# EAGLE design card_env_sensor_1 (EAGLE 9.7.0)
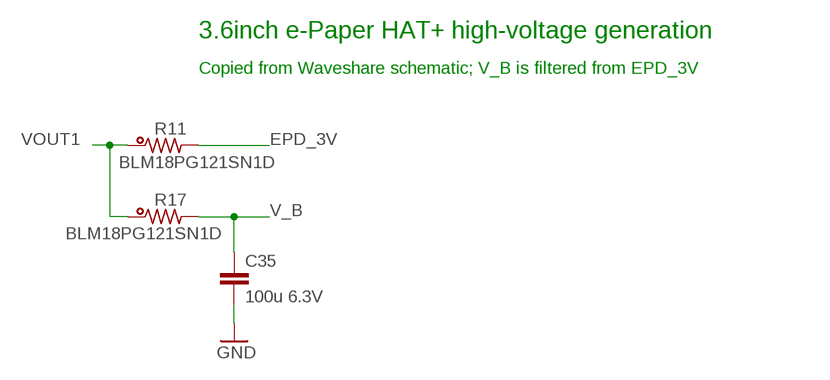
[diagram p0: schematic, sheet 1, part 1 of 2]
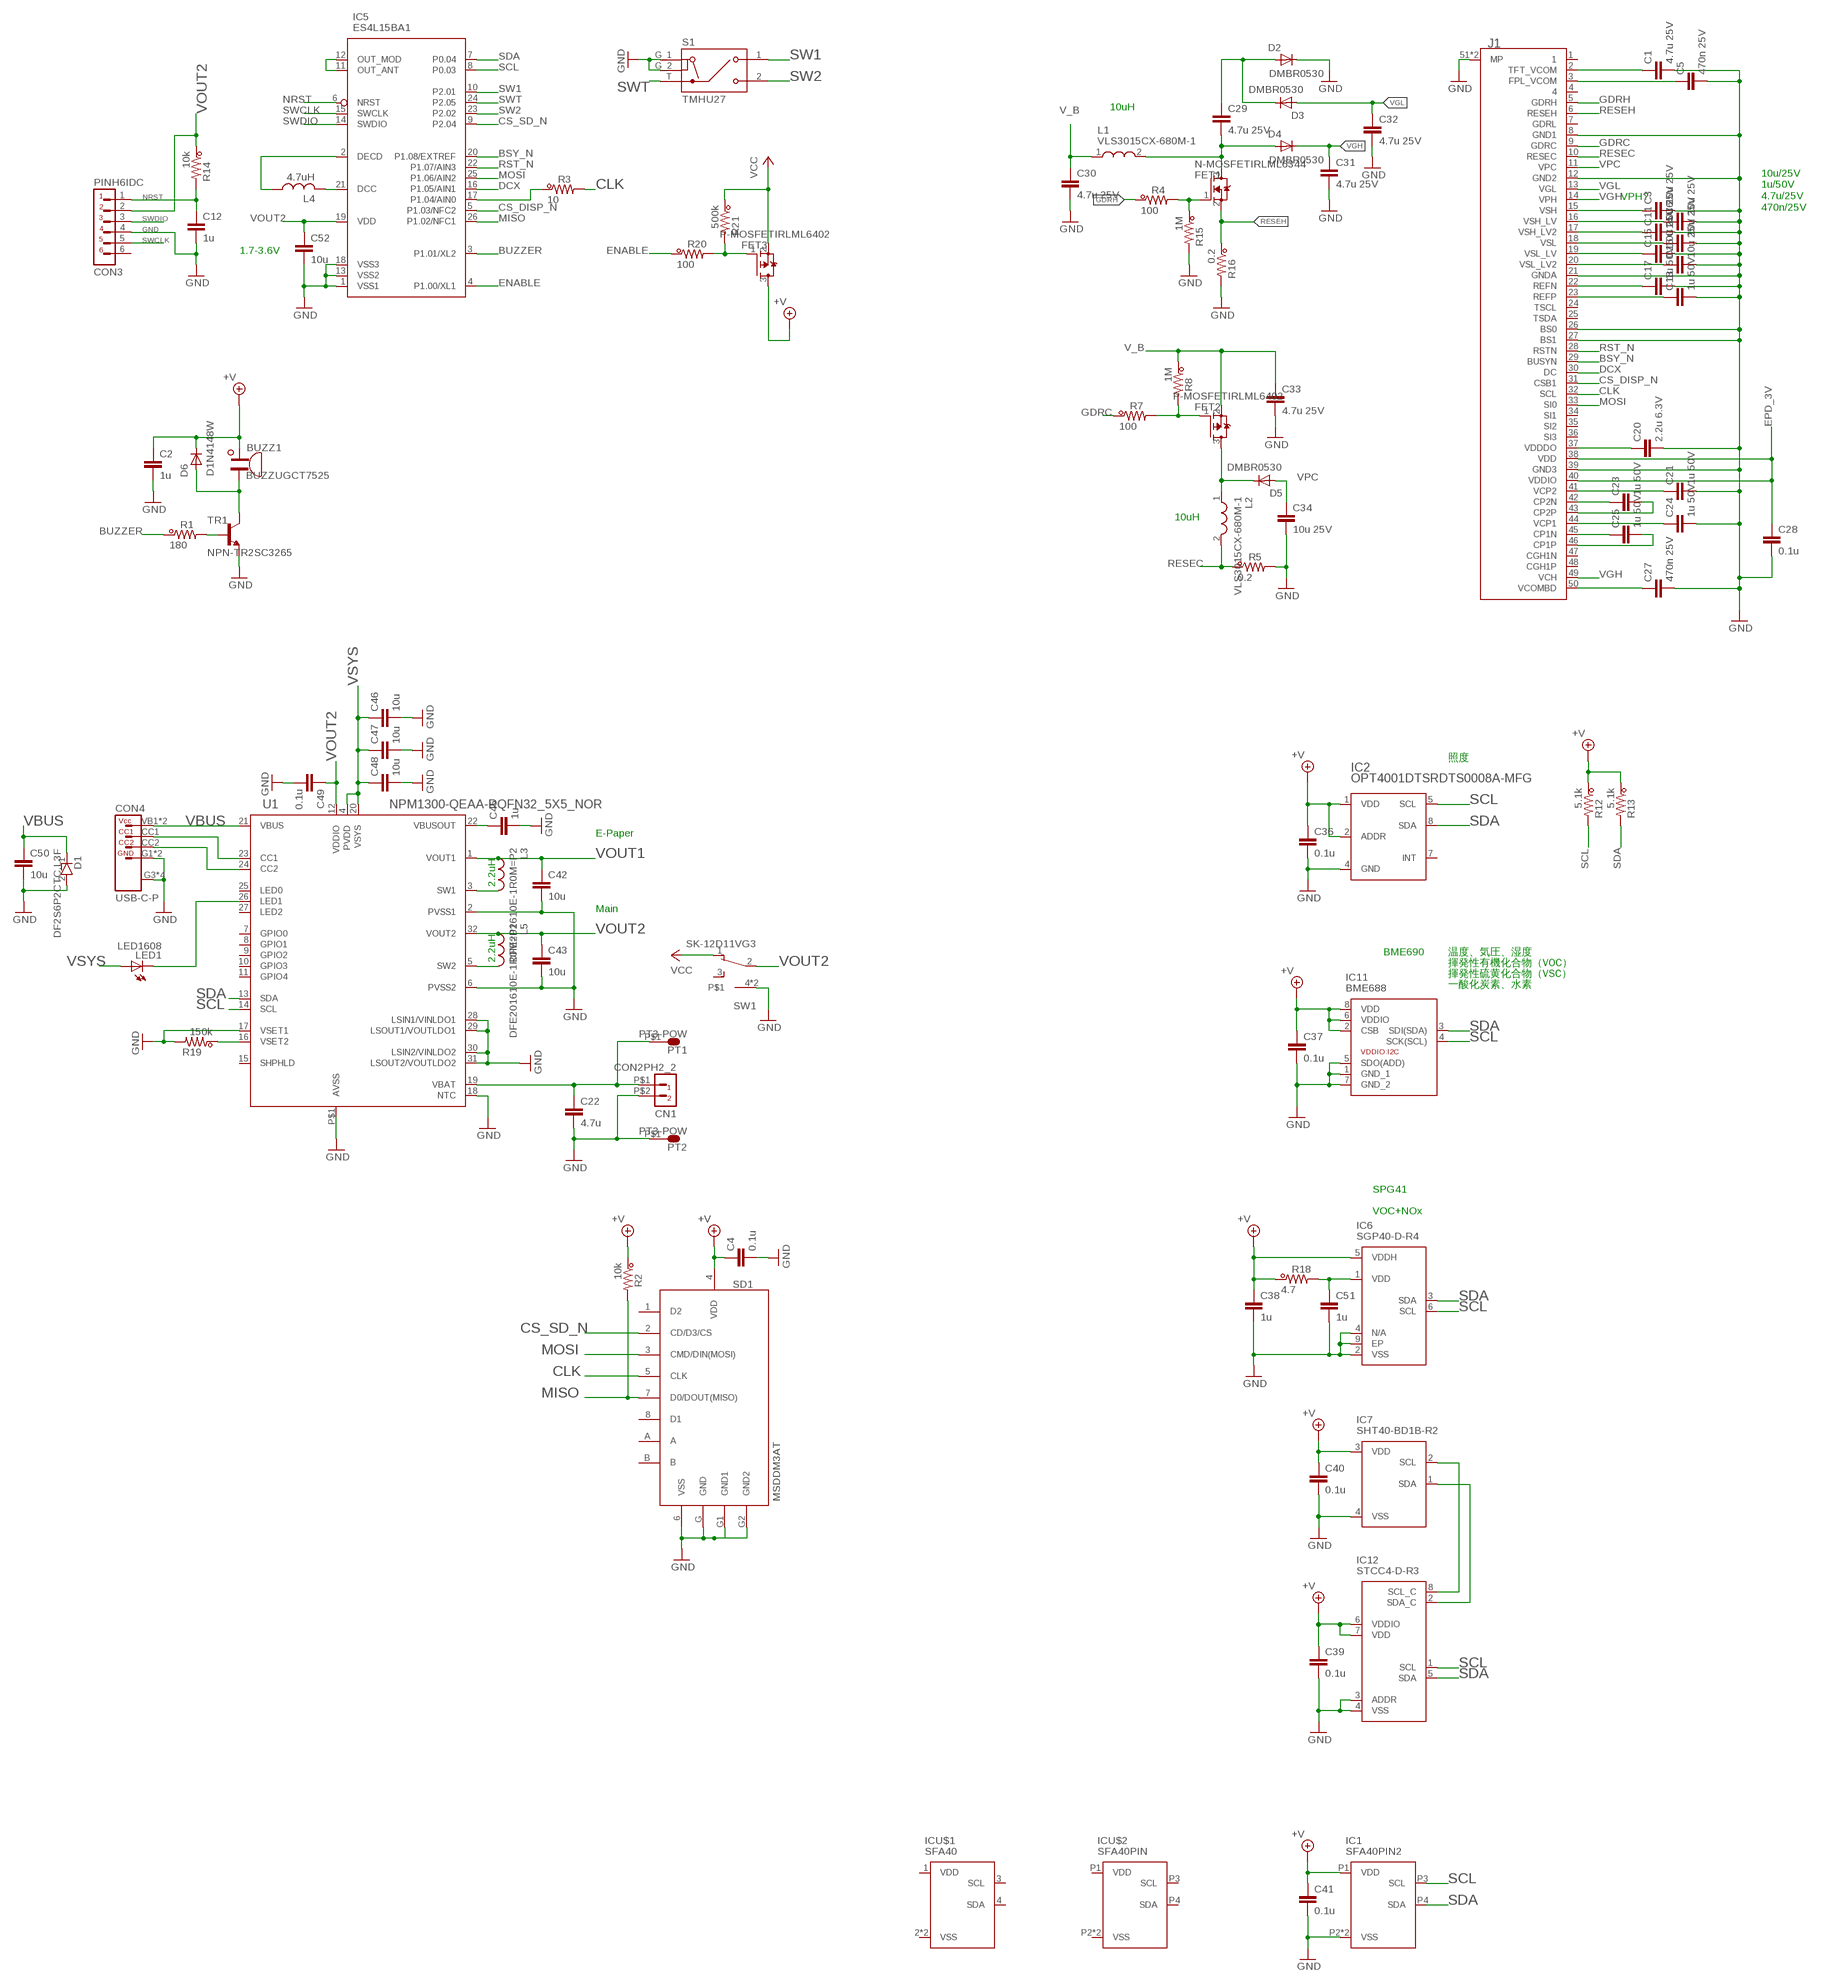
[diagram p1: schematic, sheet 1, part 2 of 2]

## Parts
BUZZ1  BUZZUGCT7525  [UGCT7525]
C1  4.7u 25V  C-CC1608A  [1608A]
C2  1u  C-CC1005A  [1005A]
C3  10u 25V  C-CC1608A  [1608A]
C4  0.1u  C-CC1005A  [1005A]
C5  470n 25V  C-CC1608A  [1608A]
C6  10u 25V  C-CC1608A  [1608A]
C11  10u 25V  C-CC1608A  [1608A]
C12  1u  C-CC1005A  [1005A]
C14  10u 25V  C-CC1608A  [1608A]
C15  10u 25V  C-CC1608A  [1608A]
C16  10u 25V  C-CC1608A  [1608A]
C17  1u 50V  C-CC1608A  [1608A]
C18  1u 50V  C-CC1608A  [1608A]
C20  2.2u 6.3V  C-CC1608A  [1608A]
C21  1u 50V  C-CC1608A  [1608A]
C22  4.7u  C-CC1608A  [1608A]
C23  1u 50V  C-CC1608A  [1608A]
C24  1u 50V  C-CC1608A  [1608A]
C25  1u 50V  C-CC1608A  [1608A]
C27  470n 25V  C-CC1608A  [1608A]
C28  0.1u  C-CC1005A  [1005A]
C29  4.7u 25V  C-CC1608A  [1608A]
C30  4.7u 25V  C-CC1608A  [1608A]
C31  4.7u 25V  C-CC1608A  [1608A]
C32  4.7u 25V  C-CC1608A  [1608A]
C33  4.7u 25V  C-CC1608A  [1608A]
C34  10u 25V  C-CC1608A  [1608A]
C35  100u 6.3V  C-CC3225  [3225-C]
C36  0.1u  C-CC1005K  [1005K]
C37  0.1u  C-CC1005K  [1005K]
C38  1u  C-CC1005K  [1005K]
C39  0.1u  C-CC1005K  [1005K]
C40  0.1u  C-CC1005K  [1005K]
C41  0.1u  C-CC1005K  [1005K]
C42  10u  C-CC1608A  [1608A]
C43  10u  C-CC1608A  [1608A]
C45  1u  C-CC1608A  [1608A]
C46  10u  C-CC1608A  [1608A]
C47  10u  C-CC1608A  [1608A]
C48  10u  C-CC1608A  [1608A]
C49  0.1u  C-CC1608A  [1608A]
C50  10u  C-CC2015  [2015]
C51  1u  C-CC1005K  [1005K]
C52  10u  C-CC1608A  [1608A]
CN1  CON2PH2_2  [PH2_2]
CON3  PINH6IDC  [1X6IDC_1R27]
CON4  USB-C-P  [USB-C-P]
D1  DF2S6P2CTC,L3F  [CST2C]
D2  DMBR0530  [SOD-123-2]
D3  DMBR0530  [SOD-123-2]
D4  DMBR0530  [SOD-123-2]
D5  DMBR0530  [SOD-123-2]
D6  D1N4148W  [1N4148W]
FET1  N-MOSFETIRLML6344  [SOT23-3]
FET2  P-MOSFETIRLML6402  [SOT23-3]
FET3  P-MOSFETIRLML6402  [SOT23-3]
IC1  SFA40PIN2  [SFA40-PIN2]
IC2  OPT4001DTSRDTS0008A-MFG  [DTS0008A-MFG]
IC5  ES4L15BA1  [ES4L15BA1]
IC6  SGP40-D-R4  [SON80P244X244X95-7N]
IC7  SHT40-BD1B-R2  [SHT40BD1BR2]
IC11  BME688  [BME688]
IC12  STCC4-D-R3  [STCC4DR3]
ICU$1  SFA40  [SFA40]
ICU$2  SFA40PIN  [SFA40-PIN]
J1  FH34SRJ-50S-0.5SH(50)CONN50X1_FH34SRJ-50S-0.5SH(50)  [CONN50X1_FH34SRJ-50S-0.5SH(50)]
L1  VLS3015CX-680M-1  [VLS3015]
L2  VLS3015CX-680M-1  [VLS3015]
L3  DFE201610E-1R0M=P2  [INDC2016X100N]
L4  4.7uH  L1608  [1608A]
L5  DFE201610E-1R0M=P2  [INDC2016X100N]
LED1  LED1608  [LED1608]
PT1  PT3-POW  [PT3-POW]
PT2  PT3-POW  [PT3-POW]
R1  180  R-CC1005A  [1005A]
R2  10k  R-CC1005A  [1005A]
R3  10  R-CC1005A  [1005A]
R4  100  R-CC1005A  [1005A]
R5  0.2  R-CC2012A  [2012A]
R7  100  R-CC1005A  [1005A]
R8  1M  R-CC1005A  [1005A]
R11  BLM18PG121SN1D  R-CC1608A  [1608A]
R12  5.1k  R-CC1005A  [1005A]
R13  5.1k  R-CC1005A  [1005A]
R14  10k  R-CC1005A  [1005A]
R15  1M  R-CC1005A  [1005A]
R16  0.2  R-CC2012A  [2012A]
R17  BLM18PG121SN1D  R-CC1608A  [1608A]
R18  4.7  R-CC1005A  [1005A]
R19  150k  R-CC1005A  [1005A]
R20  100  R-CC1005A  [1005A]
R21  500k  R-CC1005A  [1005A]
S1  TMHU27  [SW_TMHU27]
SD1  MSDDM3AT  [DM3AT]
SW1  SK-12D11VG3  [SK-12D11VG3]
TR1  NPN-TR2SC3265  [SOT23-3]
U1  NPM1300-QEAA-RQFN32_5X5_NOR  [QFN32_5X5_NOR]

## Nets
+V: BUZZ1.P(+) C2.1 C4.1 C36.1 C37.1 C38.1 C39.1 C40.1 C41.1 D6.C FET3.3(D) IC1.P1(VDD) IC2.1(VDD) IC2.2(ADDR) IC6.5(VDDH) IC7.3(VDD) IC11.2(CSB) IC11.6(VDDIO) IC11.8(VDD) IC12.6(VDDIO) IC12.7(VDD) R2.1 R12.1 R13.1 R18.1 SD1.4(VDD)
BSY_N: IC5.20(P1.08/EXTREF) J1.29(BUSYN)
BUZZER: IC5.3(P1.01/XL2) R1.1
CLK: J1.32(SCL) R3.2 SD1.5(CLK)
CS_DISP_N: IC5.5(P1.03/NFC2) J1.31(CSB1)
CS_SD_N: IC5.9(P2.04) SD1.2(CD/D3/CS)
DCX: IC5.16(P1.05/AIN1) J1.30(DC)
ENABLE: IC5.4(P1.00/XL1) R20.1
EPD_3V: C28.1 J1.38(VDD) J1.40(VDDIO) R11.2
GDRC: J1.9(GDRC) R7.1
GDRH: J1.5(GDRH) R4.1
GND: C1.2 C2.2 C3.2 C4.2 C5.2 C6.2 C11.2 C12.2 C14.2 C15.2 C16.2 C17.2 C18.2 C20.2 C21.2 C22.2 C24.2 C27.2 C28.2 C30.2 C31.2 C32.2 C33.2 C34.2 C35.2 C36.2 C37.2 C38.2 C39.2 C40.2 C41.2 C42.2 C43.2 C45.2 C46.2 C47.2 C48.2 C49.2 C50.2 C51.2 C52.2 CN1.P$2 CON3.4 CON4.G1(G) CON4.G2(G) CON4.G3(G1) CON4.G4(G1) CON4.G5(G1) CON4.G6(G1) D1.2(A) D2.C IC1.P2(VSS) IC1.P6(VSS) IC2.4(GND) IC5.1(VSS1) IC5.13(VSS2) IC5.18(VSS3) IC6.2(VSS) IC6.4(N/A) IC6.9(EP) IC7.4(VSS) IC11.1(GND_1) IC11.5(SDO(ADD)) IC11.7(GND_2) IC12.3(ADDR) IC12.4(VSS) J1.8(GND1) J1.12(GND2) J1.21(GNDA) J1.26(BS0) J1.27(BS1) J1.39(GND3) J1.51(MP) J1.52(MP) PT2.P$1 R5.2 R15.2 R16.2 R19.2 S1.G_1(C1) S1.G_2(C2) SD1.6(VSS) SD1.G1(GND1) SD1.G2(GND2) SD1.G(GND) SW1.4 SW1.5 TR1.2(E) U1.2(PVSS1) U1.6(PVSS2) U1.17(VSET1) U1.18(NTC) U1.28(LSIN1/VINLDO1) U1.29(LSOUT1/VOUTLDO1) U1.30(LSIN2/VINLDO2) U1.31(LSOUT2/VOUTLDO2) U1.P$1(AVSS)
MISO: IC5.26(P1.02/NFC1) R2.2 SD1.7(D0/DOUT(MISO))
MOSI: IC5.25(P1.06/AIN2) J1.33(SI0) SD1.3(CMD/DIN(MOSI))
N$1: IC5.17(P1.04/AIN0) R3.1
N$2: R1.2 TR1.1(B)
N$3: LED1.K(C) U1.26(LED1)
N$13: BUZZ1.N(-) D6.A TR1.3(C)
N$25: C1.1 J1.2(TFT_VCOM)
N$26: C5.1 J1.3(FPL_VCOM)
N$28: C51.1 IC6.1(VDD) R18.2
N$29: CON4.CC1 U1.23(CC1)
N$30: C29.2 D4.A FET1.3(D) L1.2
N$31: C3.1 J1.15(VSH)
N$32: C6.1 J1.16(VSH_LV)
N$34: C11.1 J1.17(VSH_LV2)
N$35: C14.1 J1.18(VSL)
N$36: C15.1 J1.19(VSL_LV)
N$37: C16.1 J1.20(VSL_LV2)
N$38: C17.1 J1.22(REFN)
N$40: C18.1 J1.23(REFP)
N$41: C21.1 J1.41(VCP2)
N$42: C23.1 J1.42(CP2N)
N$43: C23.2 J1.43(CP2P)
N$44: C27.1 J1.50(VCOMBD)
N$45: C24.1 J1.44(VCP1)
N$46: C25.1 J1.45(CP1N)
N$47: C25.2 J1.46(CP1P)
N$48: C20.1 J1.37(VDDDO)
N$49: C29.1 D2.A D3.C
N$50: FET1.1(G) R4.2 R15.1
N$51: IC5.21(DCC) L4.2
N$52: FET2.1(G) R7.2 R8.2
N$53: IC7.2(SCL) IC12.8(SCL_C)
N$54: D5.C FET2.3(D) L2.1
N$55: IC7.1(SDA) IC12.2(SDA_C)
N$56: C45.1 U1.22(VBUSOUT)
N$57: L3.2 U1.3(SW1)
N$58: R19.1 U1.16(VSET2)
N$59: L5.2 U1.5(SW2)
N$60: CON4.CC2 U1.24(CC2)
N$61: IC5.2(DECD) L4.1
N$62: FET3.1(G) R20.2 R21.2
N$63: IC5.11(OUT_ANT) IC5.12(OUT_MOD)
NRST: C12.1 CON3.1 IC5.6(NRST) R14.2
RESEC: J1.10(RESEC) L2.2 R5.1
RESEH: FET1.2(S) J1.6(RESEH) R16.1
RST_N: IC5.22(P1.07/AIN3) J1.28(RSTN)
SCL: IC1.P3(SCL) IC2.5(SCL) IC5.8(P0.03) IC6.6(SCL) IC11.4(SCK(SCL)) IC12.1(SCL) R12.2 U1.14(SCL)
SDA: IC1.P4(SDA) IC2.8(SDA) IC5.7(P0.04) IC6.3(SDA) IC11.3(SDI(SDA)) IC12.5(SDA) R13.2 U1.13(SDA)
SW1: IC5.10(P2.01) S1.1
SW2: IC5.23(P2.02) S1.2
SWCLK: CON3.5 IC5.15(SWCLK)
SWDIO: CON3.3 IC5.14(SWDIO)
SWT: IC5.24(P2.05) S1.T
V_B: C30.1 C33.1 C35.1 FET2.2(S) L1.1 R8.1 R17.2
VBAT: C22.1 CN1.P$1 PT1.P$1 U1.19(VBAT)
VBUS: C50.1 CON4.VB1(VB) CON4.VB2(VB) D1.1(K) U1.21(VBUS)
VCC: FET3.2(S) R21.1 SW1.1
VGH: C31.1 D4.C J1.14(VPH) J1.49(VCH)
VGL: C32.1 D3.A J1.13(VGL)
VOUT1: C42.1 L3.1 R11.1 R17.1 U1.1(VOUT1)
VOUT2: C43.1 C49.1 C52.1 CON3.2 IC5.19(VDD) L5.1 R14.1 SW1.2 U1.12(VDDIO) U1.32(VOUT2)
VPC: C34.1 D5.A J1.11(VPC)
VSYS: C46.1 C47.1 C48.1 LED1.A U1.4(PVDD) U1.20(VSYS)
Unconnected: CON3.6 IC2.7(INT) ICU$1.1(VDD) ICU$1.2(VSS) ICU$1.3(SCL) ICU$1.4(SDA) ICU$1.6(VSS) ICU$2.P1(VDD) ICU$2.P2(VSS) ICU$2.P3(SCL) ICU$2.P4(SDA) ICU$2.P6(VSS) J1.1 J1.4 J1.7(GDRL) J1.24(TSCL) J1.25(TSDA) J1.34(SI1) J1.35(SI2) J1.36(SI3) J1.47(CGH1N) J1.48(CGH1P) SD1.1(D2) SD1.8(D1) SD1.A SD1.B SW1.3 U1.7(GPIO0) U1.8(GPIO1) U1.9(GPIO2) U1.10(GPIO3) U1.11(GPIO4) U1.15(SHPHLD) U1.25(LED0) U1.27(LED2)

## Notes on the sheet
- 3.6inch e-Paper HAT+ high-voltage generation
- Copied from Waveshare schematic; V_B is filtered from EPD_3V
- 10uH
- VPH?
- 10u/25V
  1u/50V
  4.7u/25V
  470n/25V
- 1.7-3.6V
- 10uH
- 照度
- E-Paper
- 2.2uH
- Main
- 2.2uH
- BME690 | 温度、気圧、湿度
- 揮発性有機化合物（VOC）
- 揮発性硫黄化合物（VSC）
- 一酸化炭素、水素
- SPG41
- VOC+NOx

## Library data of the parts
BUZZ1 = dac:BUZZ; SHOP: AKI
C1-C6 C11 C12 C14-C18 C20-C25 C27-C43 C45-C52 = dac:C-CC
CN1 = dac:CON2
CON3 = dac:PINH6
CON4 = dac:USB-C-P
D1 = SamacSys_Parts:DF2S6P2CTC,L3F
D2-D6 = dac:D
FET1 = dac:N-MOSFET; PARTS: ML6344; SHOP: AKI
FET2 FET3 = dac:P-MOSFET; PARTS: ML6402; SHOP: AKI
IC1 ICU$1 ICU$2 = SamacSys_Parts:SFA40
IC2 = SamacSys_Parts:OPT4001DTSR
IC5 = SamacSys_Parts:ES4L15BA1: Board Mount Motion & Position Sensors 9-axis IMU Source: Datasheet <https://www.ceva-dsp.com/wp-content/uploads/2019/10/BNO080_085-Datasheet.pdf>
IC6 = SamacSys_Parts:SGP40-D-R4: Air Quality Sensors Gas Sensor 2.5k pcs IC Source: Datasheet; PARTS: SPG41
IC7 = SamacSys_Parts:SHT40-BD1B-R2: SENSIRION - SHT40-BD1B-R2 - Humidity and Temperature Sensor, Digital, 0% to 100% RH, I2C, DFN-EP-4, -40C to 125C Source: Datasheet <https://sensirion.com/media/documents/33FD6951/63E1087C/Datasheet_SHT4x_1.pdf>; PARTS: SHT4x-Axx
IC11 = SamacSys_Parts:BME688: Gas sensor measuring relative humidity, barometric pressure, ambient temperature and gas (VOC) Source: Datasheet <https://www.bosch-sensortec.com/media/boschsensortec/downloads/datasheets/bst-bme688-ds000.pdf>; PARTS: BME690
IC12 = SamacSys_Parts:STCC4-D-R3: Air Quality Sensors STCC4-D-R3 CO2 I2C, SMD ToR 1500 pcs 2.7V ~ 5.5V 950A 10C ~ 40C Source: Datasheet <https://sensirion.com/media/documents/6AED4B15/684A889C/CD_DS_STCC4_D1_3.pdf>
J1 = SamacSys_Parts:FH34SRJ-50S-0.5SH(50); PARTS: FH34SRJ-50S-0.5SH(50)
L1 L2 = SamacSys_Parts:VLS3015CX-680M-1: SMD / SMT Inductors (Coils), L=68?H, L x W x T : Source: Datasheet <https://product.tdk.com/system/files/dam/doc/product/inductor/inductor/smd/catalog/inductor_commercial_power_vls3015cx-1_en.pdf>; PARTS: VLS3015CX-100M-1
L3 L5 = SamacSys_Parts:DFE201610E-1R0M=P2; PARTS: DFE201610E-2R2M=P2
L4 = dac:L; PARTS: LSQPB160807T4R7M; SHOP: mouser
LED1 = dac:LED: LED rectangle, 5.7 x 3.2 mm
PT1 PT2 = dac:PT3-POW
R1-R5 R7 R8 R12-R16 R18-R21 = dac:R-CC
R11 R17 = dac:R-CC; SHOP: AKI
S1 = SamacSys_Parts:TMHU27; SHOP: AKI
SD1 = dac:MSD
SW1 = dac:SK-12D11VG3; SHOP: AKI
TR1 = dac:NPN-TR; SHOP: AKI
U1 = SamacSys_Parts:NPM1300-QEAA-R

## Board
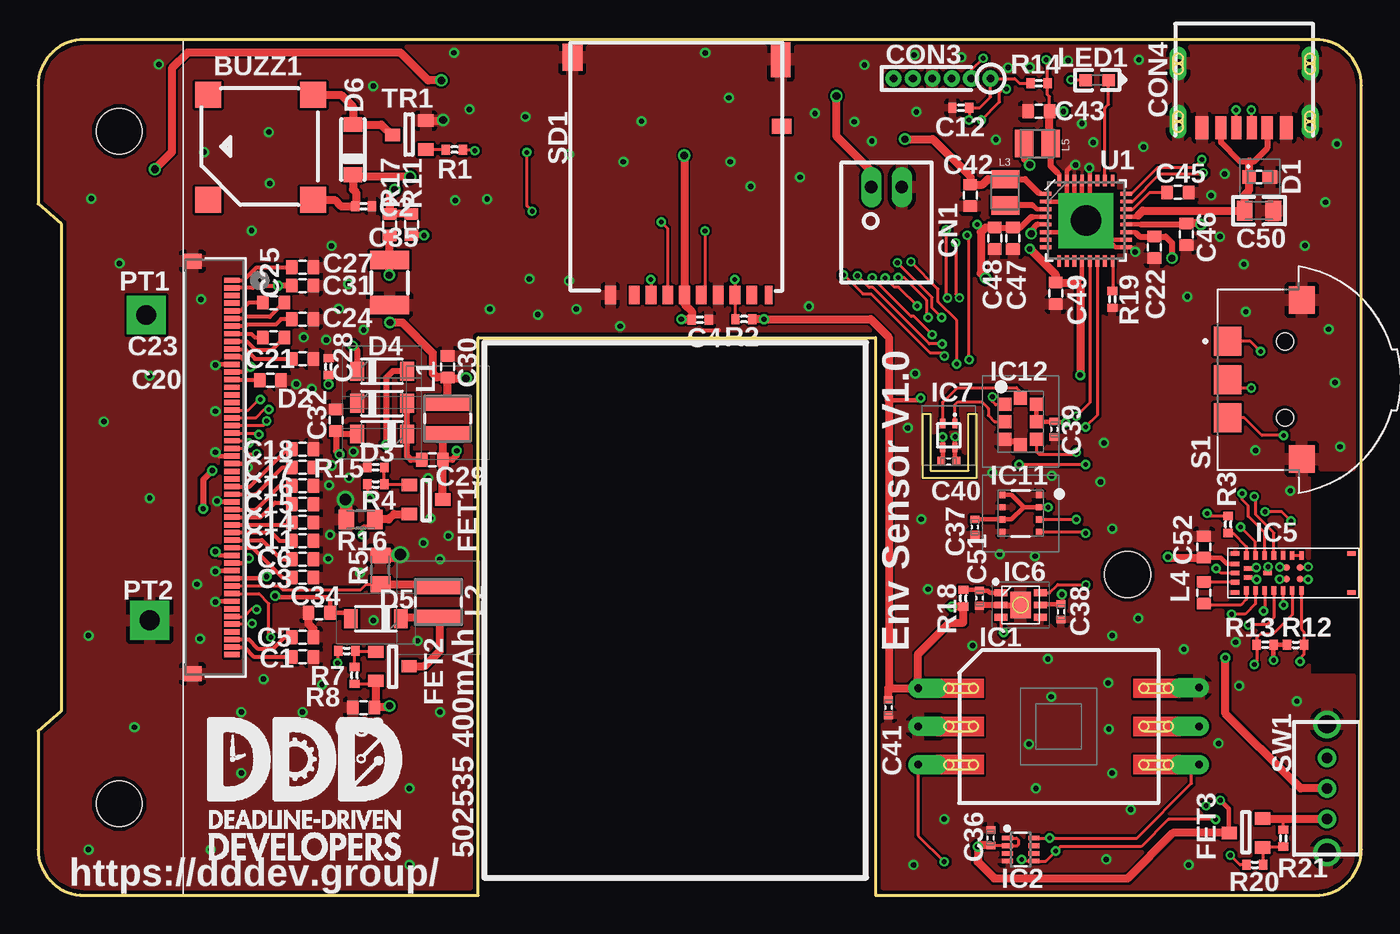
[diagram p2: board, top side]
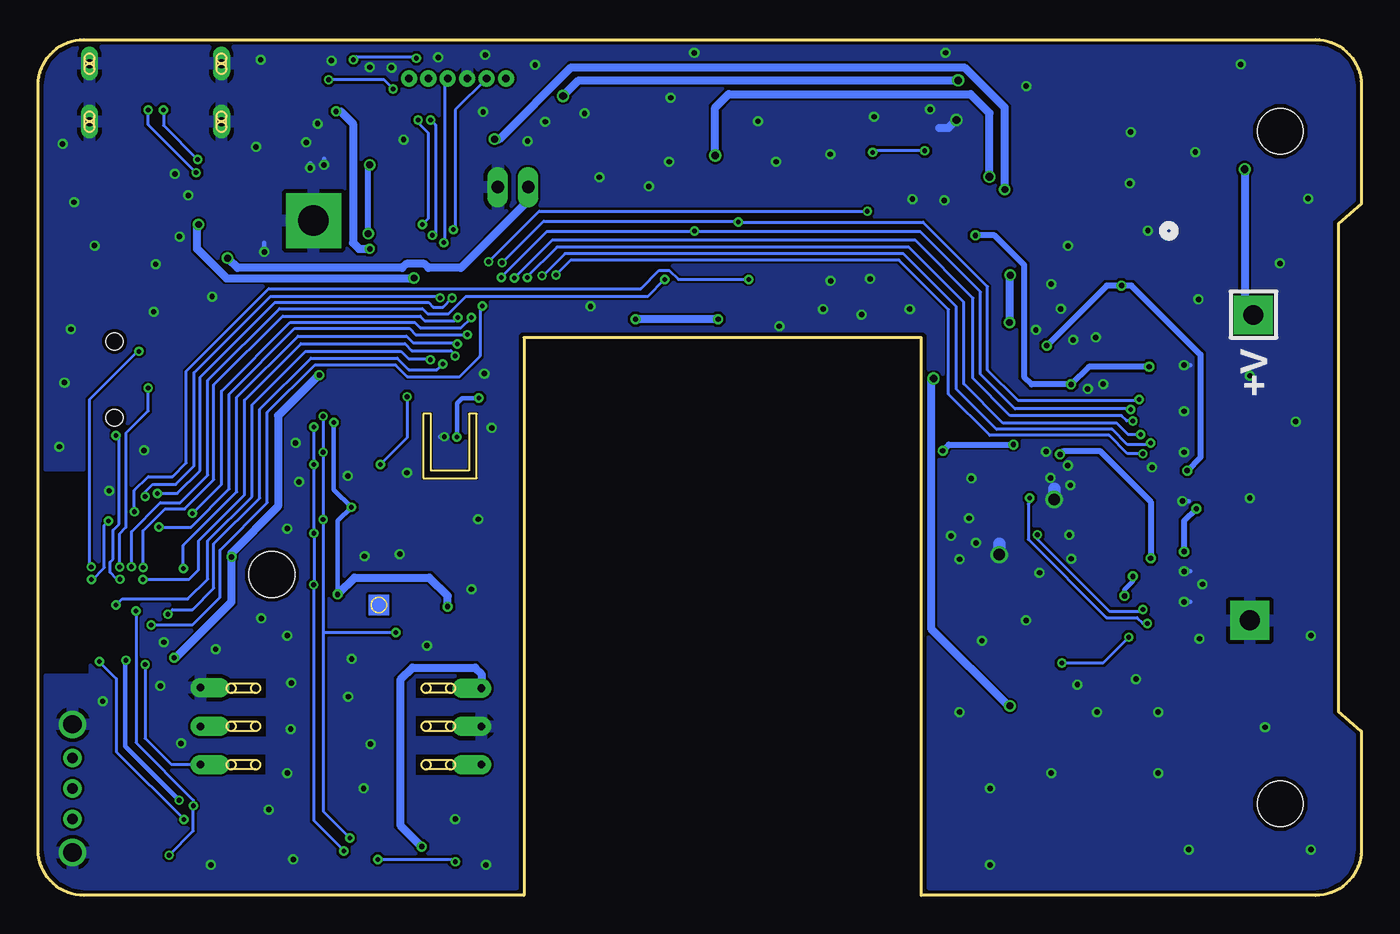
[diagram p3: board, bottom side, seen from below]

Size 86.6 x 56 mm. Coordinates in mm from the lower left corner, seen from the top.
Outline: 0,10.75 0,3 arc90 3,0 28.8,0 28.8,36.5 54.8,36.5 54.8,0 83.6,0 arc90 86.6,3 86.6,53 arc90 83.6,56 3,56 arc90 0,53 0,45.25 1.5,43.95 1.5,12.05 0,10.75
Copper layers (1*16): Top / Bottom
Stack-up Default Layer Stack: Top User Defined 0.035mm / Dielectric-1 User Defined 1.5mm / Bottom User Defined 0.035mm
Design rules: minimum drill size 12mil, copper clearance wire_polygon to wire_polygon 6mil, copper clearance wire_polygon to pad_smd 6mil, copper clearance wire_polygon to via 6mil, copper clearance pad_smd to pad_smd 6mil, copper clearance pad_smd to via 6mil, copper clearance via to via 6mil, copper clearance smd to pad (same net) 0mil, copper clearance smd to via (same net) 0mil, copper clearance smd to smd (same net) 0mil, dimension clearance 10mil, via restrict clearance 0mil, drill distance 10mil, keepout clearance 0mil
Holes 3 mm at 5.3,50 5.3,6 71.3,21
RestrictCopper: area 83.3,14.5 to 86.3,27.8; area 83.3,14.5 to 86.3,27.7; area 59.3,12.9 to 61.9,14.2; area 59.3,10.5 to 61.9,11.7; area 59.3,7.9 to 61.9,9.2; area 71.7,12.9 to 74.2,14.2; area 71.7,10.4 to 74.2,11.7; area 71.7,7.9 to 74.2,9.2; area 57.8,27.2 to 61.5,31.6; area 57.8,27.2 to 61.5,31.6; area 57.8,27.2 to 61.5,31.6; area 57.8,27.2 to 61.5,31.6; 1 lines
Milling: 8 lines

### Footprints (pad centres in the part's own frame; a part is rotated, then mirrored left to right if it is on the bottom)
UGCT7525 = smd 1.7 x 1.7: N -3.493,-3.373; P -3.493,3.493; P$3 3.373,-3.373; P$4 3.373,3.493
1608A = smd 0.75 x 0.9: 1 -0.7,0; 2 0.7,0
1005A = smd 0.55 x 0.65: 1 -0.55,0; 2 0.55,0
3225-C = smd 1.2 x 2.55: 1 -1.47,0; 2 1.47,0
1005K = smd 0.5 x 0.6: 1 -0.5,0; 2 0.5,0
2015 = smd 1.016 x 1.3: 1 -0.94,0; 2 0.94,0
PH2_2 = drill 0.82 long: P$1 1,0; P$2 -1,0
1X6IDC_1R27 = drill 0.5 pad 1.05: 1 -3.81,0; 2 -2.54,0; 3 -1.27,0; 4 0,0; 5 1.27,0; 6 2.54,0
USB-C-P = smd 0.65 x 1.5: CC1 -0.5,4.2; CC2 0.5,4.2 | smd 0.85 x 1.5: G1 2.75,4.2; G2 -2.75,4.2 | drill 0.6 long: G3 -4.32,0; G4 -4.32,3.8; G5 4.32,0; G6 4.32,3.8 | smd 0.75 x 1.5: VB1 1.52,4.2; VB2 -1.52,4.2
CST2C = smd 0.9 x 0.9: 1 0,-0.7 | smd 0.9 x 1: 2 0,0.65
SOD-123-2 = smd 0.91 x 1.22: A 1.635,0; C -1.635,0
1N4148W = smd 0.97 x 1.22: A 1.64,0; C -1.64,0
SOT23-3 = smd 0.8 x 1: 1 -0.95,-1.1; 2 0.95,-1.1; 3 0,1.08
SFA40-PIN2 = drill 0.5 pad 1.27 offset: P1 -9.2,2.5; P2 -9.2,0; P3 -9.2,-2.5; P4 9.2,-2.5; P5 9.2,0; P6 9.2,2.54
DTS0008A-MFG = smd 0.72 x 0.3: 1 -0.86,0.75; 2 -0.86,0.25; 3 -0.86,-0.25; 4 -0.86,-0.75; 5 0.86,-0.75; 6 0.86,-0.25; 7 0.86,0.25; 8 0.86,0.75
ES4L15BA1 = smd 0.55 x 0.3: 1 -3.8,-1.275; 18 -3.8,1.275; 19 -3.8,0.6; 20 -3.8,0; 21 -3.8,-0.6; 22 -2.95,-0.3; 25 -2.95,0.3; 26 -1.675,0; 27 3.8,-1.275; 28 3.8,1.275 | smd 0.3 x 0.55: 2 -3.075,-1.15; 3 -2.475,-1.15; 4 -1.875,-1.15; 5 -1.275,-1.15; 6 -0.675,-1.15; 7 -0.075,-1.15; 8 0.525,-1.15; 11 0.525,1.15; 12 -0.075,1.15; 13 -0.675,1.15; 14 -1.275,1.15; 15 -1.875,1.15; 16 -2.475,1.15; 17 -3.075,1.15 | smd 0.45 x 0.45: 9 0.45,-0.375; 10 0.45,0.375; 23 -0.45,-0.375; 24 -0.45,0.375
SON80P244X244X95-7N = smd 0.85 x 0.45: 1 -1.3,0.8; 2 -1.3,0; 3 -1.3,-0.8; 4 1.3,-0.8; 5 1.3,0; 6 1.3,0.8 | smd 1.35 x 1.73: 9 0,0
SHT40BD1BR2 = smd 0.62 x 0.35: 1 -0.79,0.4; 2 -0.79,-0.4; 3 0.79,-0.4; 4 0.79,0.4
BME688 = smd 0.4 x 0.4: 1 1.2,1.2; 2 1.2,0.4; 3 1.2,-0.4; 4 1.2,-1.2; 5 -1.2,-1.2; 6 -1.2,-0.4; 7 -1.2,0.4; 8 -1.2,1.2
STCC4DR3 = smd 0.85 x 0.85: 1 -1.025,1.15; 2 -1.025,0; 3 -1.025,-1.15; 4 0,-1.525; 5 1.025,-1.15; 6 1.025,0; 7 1.025,1.15; 8 0,1.525
SFA40 = smd 1.5 x 1.2: 1 -6.6,2.5; 2 -6.6,0; 3 -6.6,-2.5; 4 6.6,-2.5; 5 6.6,0; 6 6.6,2.5
SFA40-PIN = drill 0.6 offset: P1 -8.414,2.5; P2 -8.414,0; P3 -8.414,-2.5; P4 8.414,-2.5; P5 8.414,0; P6 8.414,2.54
CONN50X1_FH34SRJ-50S-0.5SH(50) = smd 0.356 x 1: 1 12.25,1.13; 2 11.75,1.13; 3 11.25,1.13; 4 10.75,1.13; 5 10.25,1.13; 6 9.75,1.13; 7 9.25,1.13; 8 8.75,1.13; 9 8.25,1.13; 10 7.75,1.13; 11 7.25,1.13; 12 6.75,1.13; 13 6.25,1.13; 14 5.75,1.13; 15 5.25,1.13; 16 4.75,1.13; 17 4.25,1.13; 18 3.75,1.13; 19 3.25,1.13; 20 2.75,1.13; 21 2.25,1.13; 22 1.75,1.13; 23 1.25,1.13; 24 0.75,1.13; 25 0.25,1.13; 26 -0.25,1.13; 27 -0.75,1.13; 28 -1.25,1.13; 29 -1.75,1.13; 30 -2.25,1.13; 31 -2.75,1.13; 32 -3.25,1.13; 33 -3.75,1.13; 34 -4.25,1.13; 35 -4.75,1.13; 36 -5.25,1.13; 37 -5.75,1.13; 38 -6.25,1.13; 39 -6.75,1.13; 40 -7.25,1.13; 41 -7.75,1.13; 42 -8.25,1.13; 43 -8.75,1.13; 44 -9.25,1.13; 45 -9.75,1.13; 46 -10.25,1.13; 47 -10.75,1.13; 48 -11.25,1.13; 49 -11.75,1.13; 50 -12.25,1.13 | smd 1 x 1.2: 51 -13.5,-1.455; 52 13.5,-1.455
VLS3015 = smd 1 x 3: 1 -1,0; 2 1,0
INDC2016X100N = smd 1.2 x 1.82: 1 -0.86,0; 2 0.86,0
LED1608 = smd 0.8 x 0.8: A -0.75,0; K 0.75,0
PT3-POW = drill 1.295 pad 2.54 square: P$1 0,0
2012A = smd 1.016 x 1.3: 1 -0.94,0; 2 0.94,0
SW_TMHU27 = smd 1.9 x 1.8: 1 2.5,3.55; 2 -2.5,3.55; T 0,3.55 | smd 1.8 x 1.7: G_1 -5.2,-1.3; G_2 5.2,-1.3 | hole 1.1: -2.5,-0.2; 2.5,-0.2
DM3AT = smd 1.2 x 0.7: 1 -5.046,7.7; 2 -5.046,6.6; 3 -5.046,5.5; 4 -5.046,4.4; 5 -5.046,3.3; 6 -5.046,2.2; 7 -5.046,1.1; 8 -5.046,0; G -5.046,9.25 | smd 1.2 x 0.5: A -5.046,-1.1 | smd 1 x 1.3: B 6,-1.96 | smd 1.778 x 1.3: G1 10.507,11.737 | smd 2.286 x 1.3: G2 10.358,-1.893
SK-12D11VG3 = drill 0.69 pad 1.2: 1 -2,0; 2 0,0; 3 2,0 | drill 1.2: 4 4.2,0; 5 -4.2,0
QFN32_5X5_NOR = smd 0.762 x 0.254: 1 -2.636,1.75; 2 -2.636,1.25; 3 -2.636,0.75; 4 -2.636,0.25; 5 -2.636,-0.25; 6 -2.636,-0.75; 7 -2.636,-1.25; 8 -2.636,-1.75; 17 2.636,-1.75; 18 2.636,-1.25; 19 2.636,-0.75; 20 2.636,-0.25; 21 2.636,0.25; 22 2.636,0.75; 23 2.636,1.25; 24 2.636,1.75 | smd 0.254 x 0.762: 9 -1.75,-2.636; 10 -1.25,-2.636; 11 -0.75,-2.636; 12 -0.25,-2.636; 13 0.25,-2.636; 14 0.75,-2.636; 15 1.25,-2.636; 16 1.75,-2.636; 25 1.75,2.636; 26 1.25,2.636; 27 0.75,2.636; 28 0.25,2.636; 29 -0.25,2.636; 30 -0.75,2.636; 31 -1.25,2.636; 32 -1.75,2.636 | drill 2 pad 3.6 square: P$1 0,0

### Placement (x,y rotation side)
BUZZ1  14.5,49 180 top
C1  17.3,15.6 0 top
C2  21.3,45.1 0 top
C3  17.3,20.8 0 top
C4  43.33,37.68 0 top
C5  17.3,16.9 0 top
C6  17.3,22 0 top
C11  17.3,23.2 0 top
C12  60.39,51.53 180 top
C14  17.3,24.4 0 top
C15  17.3,25.6 0 top
C16  17.3,26.8 0 top
C17  17.3,28 0 top
C18  17.3,29.2 0 top
C20  15.2,33.7 0 top
C21  17.3,35.1 0 top
C22  73.06,42.4 270 top
C23  15.4,36.5 180 top
C24  17.3,37.7 0 top
C25  15.4,38.8 180 top
C27  17.3,41.1 0 top
C28  19,34.6 90 top
C29  25.8,28.5 0 top
C30  26.8,34.6 90 top
C31  17.3,39.9 0 top
C32  19.5,31.1 90 top
C33  21.3,12.3 180 top
C34  18.4,18.5 180 top
C35  23,40.1 270 top
C36  62.35,3.77 90 top
C37  61.3,24.1 270 top
C38  66.94,18.56 270 top
C39  66.5,30.5 270 top
C40  59.6,28.4 0 top
C41  55.65,12.29 270 top
C42  61,45.8 270 top
C43  65.5,51.3 180 top
C45  74.6,46 0 top
C46  75.14,43.27 270 top
C47  63.8,43 270 top
C48  62.6,43 270 top
C49  66.6,39.4 270 top
C50  79.9,44.8 0 top
C51  61.6,19.45 270 top
C52  76.3,22.8 90 top
CN1  55.53,46.34 180 top
CON3  58.52,53.45 180 top
CON4  78.92,54.42 180 top
D1  79.96,47 270 top
D2  22.5,32.2 0 top
D3  22.5,30.2 180 top
D4  22.5,34.3 0 top
D5  22.1,18.1 180 top
D6  20.6,48.8 90 top
FET1  25.4,25.9 270 top
FET2  23.2,15 270 top
FET3  79.04,4.09 90 top
IC1  66.79,11.06 0 top
IC2  64.3,3 0 top
IC5  82.15,21.09 0 top
IC6  64.3,19 0 top
IC7  59.6,30.1 270 top
IC11  64.3,25 0 top
IC12  64.3,31 0 top
ICU$1  65.29,-10.39 0 top  (outside the outline)
ICU$2  65.29,-22.09 0 top  (outside the outline)
J1  11.55,28 270 top
L1  26.8,31.2 270 top
L2  26.2,19.2 90 top
L3  63.3,46 270 top
L4  76.3,19.8 90 top
L5  65.4,49.2 180 top
LED1  69.31,53.34 0 top
PT1  7.07,37.98 0 top
PT2  7.3,18 0 top
R1  27.24,48.79 180 top
R2  46.19,37.7 180 top
R3  77.88,24.27 90 top
R4  22.1,26.9 0 top
R5  22.4,21.3 90 top
R7  20.2,16 0 top
R8  20.7,14.4 90 top
R11  24.42,43.9 270 top
R12  82.3,16.4 0 top
R13  80.3,16.4 180 top
R14  65.51,53.14 180 top
R15  22.1,28 180 top
R16  21.1,24.6 180 top
R17  23,43.89 270 top
R18  60.55,19.45 90 top
R19  70.3,39 270 top
R20  79.63,2 0 top
R21  81.49,3.75 270 top
S1  81.4,33.75 90 top
SD1  46.71,44.33 90 top
SW1  84.35,7 90 top
TR1  24.27,49.75 90 top
U1  68.57,44.15 0 top

### Tracks (layer width: path | path; a pad name or v marks a point on that pad's centre or on a via)
+V  (via drill 0.3, 0.35, 0.5)
  Top 0.2: IC2.1 64.05,3.75 64.15,3.65 64.15,3.33 64.07,3.25 IC2.2 62.37,3.25 C36.1
  Top 0.305: v67.25,30.95 66.55,30.95 C39.1 IC12.6 IC12.7 | v66.1,25.4 IC11.2 64.5,25.4 | C37.1 IC11.6 63.7,24.6 64.5,25.4 | v67,19.7 67.04,19.66 67.04,19.16 C38.1 65.66,19.06 IC6.5 | IC11.8 63.7,26.2 64.5,25.4 | v80.86,15.39 v80.85,15.4 R13.1 R12.1 | FET3.3 77.93,4.12 77.93,5.67 v77.37,6.23 | C40.1 59.2,28.5 IC7.3 v59.2,29.99 v59.19,30 | 55.68,32.4 57.61,32.4 v57.75,32.54
  Top 0.508: BUZZ1.P 19.39,45.51 19.8,45.1 C2.1 20.8,45.15 20.8,46 20.6,46.2 D6.C 20.74,47.02 v24.34,47.02 | v42.29,48.41 42.29,39.3 SD1.4 42.31,38.69 42.78,38.22 C4.1 42.12,37.68 v42.1,37.7 | R2.1 v47.5,37.7 54.49,37.7 55.68,36.51 55.68,32.4 55.68,13.56 | 55.68,13.56 55.64,13.56 55.65,13.55 C41.1 | 55.68,13.56 IC1.P1 57.59,15.79 59.65,17.85 60.55,17.85 R18.1 v59.8,18.9 | C36.1 61.57,3.27 v61.5,3.2 61.5,2.2 62.58,1.12 71.31,1.12 74.28,4.09 FET3.3
  Bottom 0.305: v67.25,30.95 67.25,26.55 v66.1,25.4 67,24.5 v67,19.7 | v77.37,6.23 77.42,6.28 77.43,6.28 80.9,9.75 80.9,15.35 v80.86,15.39 | v57.75,32.54 58.84,32.54 59.19,32.19 v59.19,30
  Bottom 0.508: v42.29,48.41 42.29,51.55 41.41,52.43 25.58,52.43 24.34,51.19 v24.34,47.02 | v42.1,37.7 v47.5,37.7 | v61.5,3.2 62.9,4.6 62.9,14.1 62.1,14.9 58,14.9 57.59,14.49 IC1.P1 | v59.8,18.9 59.8,19.6 61,20.8 65.9,20.8 v67,19.7
BSY_N  (via drill 0.3)
  Top 0.2: IC5.20 77.41,21.09 v77.1,21.4 | J1.29 13.65,29.75 v13.8,29.6 | v53.62,40.55 54.39,39.78 54.63,39.78 58.33,36.08 v59.16,36.08
  Bottom 0.2: v77.1,21.4 77.1,22.9 73.6,26.4 73.6,32.6 69.6,36.6 62.5,36.6 62.05,36.15 59.23,36.15 v59.16,36.08 | v13.8,29.6 13.9,29.5 15.3,29.5 16.3,30.5 23.88,30.5 26.51,33.13 26.51,38.52 29.98,41.99 52.13,41.99 53.59,40.52 v53.62,40.55
BUZZER  (via drill 0.3)
  Top 0.2: IC5.3 79.67,19.07 79,18.4 v78.1,18.4 | v32.33,44.77 31.99,45.11 v31.99,48.62 | v28.57,48.72 28.5,48.79 R1.1 | v57.12,41.46 v57.12,41.45 58.9,39.67 58.9,38.86 60.12,37.64 v60.12,34.78
  Bottom 0.2: v78.1,18.4 77.8,18.7 76.5,18.7 75.1,20.1 75.1,23 72.1,26 72.1,31.8 68.75,35.15 63.1,35.15 62.35,34.4 60.5,34.4 v60.12,34.78 | v32.33,44.77 53.81,44.77 v57.12,41.46 | v31.99,48.62 31.84,48.77 28.62,48.77 v28.57,48.72
CLK  (via drill 0.3)
  Top 0.2: R3.2 76.68,24.82 v76.5,25 | J1.32 14.25,31.25 14.8,31.8 v15.1,31.8 | v43.64,43.48 43.64,39.51 SD1.5 | v58.25,37.81 58.13,37.93 58.13,38.97 56.66,40.44 v56.28,40.44
  Bottom 0.2: v76.5,25 74.6,26.9 74.6,33 70.1,37.5 61.95,37.5 61.6,37.15 58.91,37.15 v58.25,37.81 | v15.1,31.8 15.14,31.84 22.67,31.84 24.93,34.1 24.93,39.49 28.89,43.45 43.61,43.45 v43.64,43.48 43.67,43.45 53.3,43.45 56.28,40.47 v56.28,40.44
CS_DISP_N  (via drill 0.3)
  Top 0.2: IC5.5 80.88,18.18 80.4,17.7 v79.2,17.7 | J1.31 14.75,30.75 15,31 v14.95,31.05 | v55.43,40.4 56.03,39.8 56.31,39.8 v57.54,38.57
  Bottom 0.2: v79.2,17.7 76.5,17.7 74.7,19.5 74.7,22.6 71.6,25.7 71.6,31.6 68.5,34.7 63.2,34.7 62.45,33.95 59.01,33.95 57.68,35.28 57.68,38.43 v57.54,38.57 | v14.95,31.05 15.35,31.05 15.7,31.4 22.99,31.4 25.41,33.83 25.41,39.09 29.2,42.87 52.96,42.87 v55.43,40.4
CS_SD_N  (via drill 0.3, 0.3 pad 0.4)
  Top 0.2: IC5.9 82.98,20.72 83.07,20.63 v83.11,20.67 | v82,24.5 81.4,25.1 v80.3,25.1 | v40.1,40.3 v40.11,40.29 SD1.2
  Bottom 0.2: v83.11,20.67 83.04,20.67 82.27,21.44 82.27,24.23 v82,24.5 | v80.3,25.1 80.3,26.5 79.4,27.4 77.8,27.4 76.9,28.3 76.9,34.3 71.5,39.7 47.15,39.7 45.95,40.9 45.3,40.9 44.7,40.3 v40.1,40.3
DCX  (via drill 0.3)
  Top 0.2: IC5.16 79.67,23.12 v78.7,24.1 | J1.30 14.25,30.25 14.3,30.3 v14.45,30.15 | v54.59,40.42 57.13,37.88 57.33,37.88 v58.52,36.69
  Bottom 0.2: v78.7,24.1 76.6,24.1 74.1,26.6 74.1,32.8 69.8,37.1 62.3,37.1 61.9,36.7 v58.53,36.7 v58.52,36.69 | v14.45,30.15 15.25,30.15 16,30.9 23.45,30.9 26.02,33.47 26.02,38.82 29.62,42.42 52.64,42.42 54.59,40.47 v54.59,40.42
ENABLE  (via drill 0.3)
  Top 0.2: IC5.4 80.28,18.68 v80.2,18.6 | R20.1 78.66,2 v78.03,2.63
  Bottom 0.2: v80.2,18.6 80.2,10 76.44,6.24 v76.44,5.87 76.44,4.22 v78.03,2.63
EPD_3V  (via drill 0.35)
  Top 0.305: J1.38 13.55,34.25 v13.89,34.59 13.89,34.61 13.25,35.25 J1.40
  Top 0.406: v19,33.43 C28.1 | v25.26,43.18 24.44,43.18 R11.2
  Bottom 0.406: v13.89,34.59 17.84,34.59 v19,33.43 21.57,33.43 22.08,33.94 22.08,41.26 24,43.18 v25.26,43.18
GDRC  (via drill 0.3)
  Top 0.2: J1.9 14.45,19.75 15.1,19.1 15.1,17.01 v15.22,16.89 | R7.1 19.6,15.95 v19.6,15.2
  Bottom 0.2: v19.6,15.2 19.58,15.22 16.89,15.22 v15.22,16.89
GDRH  (via drill 0.3)
  Top 0.2: R4.1 21.55,26.15 v21.7,26 | v14,17.8 13.95,17.75 J1.5
  Bottom 0.2: v21.7,26 21.7,25.7 21.8,25.6 21.8,23.3 16.68,18.18 14.68,18.18 14.3,17.8 v14,17.8
GND  (via drill 0.3, 0.35, 0.5, 0.75)
  Top 0.2: 43.04,37.03 43.04,36.99
  Top 0.254: 43.04,36.99 44.53,36.99
  Top 0.305: J1.39 11.75,34.75 11.7,34.7 v11.6,34.7 | J1.21 11.85,25.75 11.8,25.8 v11.7,25.8 | J1.27 11.85,28.75 v11.6,29 | J1.26 13.45,28.25 v13.7,28 | J1.12 11.75,21.25 11.7,21.2 v11.6,21.2 | J1.8 11.65,19.25 v11.6,19.2 | U1.2 67.32,45.4 | 67.32,45.4 67.82,44.9 | 68.01,44.71 U1.P$1 67.82,43.4 U1.6 | 67.32,45.4 U1.31 67.32,47.42 67.7,47.8 v67.9,47.8 | U1.30 67.82,44.9 | 67.82,44.9 68.01,44.71 | U1.29 68.32,45.02 | 68.32,45.02 68.01,44.71 | 68.32,45.02 68.82,45.52 U1.28 68.82,47.58 v68.8,47.6 | 70,42.9 70.5,42.4 U1.17 71.5,42.4 v71.8,42.1 | 70,42.9 69.7,43.2 | U1.18 70,42.9 | C40.2 60,28.5 IC7.4 v60,30 v60.01,30.01
  Top 0.406: IC12.4 64.09,29.68 63.44,29.68 IC12.3 | IC6.9 IC6.2 61.65,19 C51.2
  Top 0.508: TR1.2 26.46,50.7 v26.5,50.74 | C5.2 18,17.45 17.7,17.75 C34.2
  Top 0.813: R16.2 20.16,25.84 v20.1,25.9 | R5.2 23.64,22.24 v23.7,22.3
  Bottom 0.305: v11.6,34.7 11.2,34.7 | v11.7,25.8 11.3,25.8 | v11.6,21.2 11.2,21.2 | v11.6,19.2 11.2,19.2 | v67.9,47.8 67.9,48.2 | v68.8,47.6 68.8,47.9 | v71.8,42.1 71.8,42.7 | v60.01,30.01 v60.02,30.02 60.28,30.02
  Bottom 0.508: 27.64,50.22 27.02,50.22 v26.5,50.74
  Bottom 0.813: v20.1,25.9 20.1,26.6 | v23.7,22.3 23.7,23
  other vias: 38.3,48 45.2,52.19 45.3,48 50.84,51.17 49.87,46.99 50.45,38.54 57.4,34.14 56.91,30.59 57.8,24.61 70.3,17 66.3,13 70.3,8 70.3,24 75.3,2 65.3,7 59.3,5 57.3,2 69.9,2.36 58.24,20.03 26.3,12 17.3,12 13.3,8 24.3,7 24.3,2 20.3,8 13.3,12 6.3,11 11.3,3 3.3,3 3.3,17 7.3,26 4.3,31 7.3,34 20.3,40 21.3,37 25.22,23.06 20.64,29.04 26.3,22 24.83,16.66 21.06,21.11 18.99,22.03 19.22,28.13 17.91,33.14 18.86,36.35 19.67,38.37 17.39,36.51 16.89,33.46 19.04,26.84 19.11,23.59 10.66,39 11.6,31.68 10.4,20.36 10.59,16.79 5.33,41.35 15.09,49.94 7.9,54.37 3.48,45.59 15.16,46.59 13.97,43.5 19.19,42.5 10.86,48.64 21.93,52.95 31.89,50.95 27.3,45.48 29.38,45.56 39.49,50.65 28.23,51.43 38.09,37.24 62.46,27.66 54.08,54.34 57.48,51.26 62.68,49.45 64.9,54.19 72.04,54.68 68.31,50.5 57.34,54.99 72.35,48.97 69.05,49.27 77.35,43.11 75.21,39.18 79.04,38.19 78.91,41.3 82.91,42.52 84.25,45.35 85.01,49.17 84.46,37.04 84.88,33.56 85.21,29.36 79.67,29.12 78.38,16.57 82.38,12.71 78.61,13.71 74.98,16.11 81.95,26.48 18.58,13.8 14.75,14.15 21.94,17.99 76.77,45.8 77.66,47.21 20.34,27.32 25.53,27.28 25.67,24.68 26.85,23.52 34.73,40.21 35.22,38.36 32.15,40.34 29.56,38.36 32.71,38 34.76,48.49 46.63,46.39 69.76,29.61 69.53,27.06 72,18.13 70.03,13.9 70.08,10.88 71.51,5.62 77.25,9.95 66.09,15.47 61.16,16.35 64.85,9.9 65.24,22.19 62.93,22.33 66.34,27.45 53.42,50.62 54.57,49.36 27.21,55.14 43.66,55.12 67.41,54.62 63.48,54.17 60.41,54.83
  pour Top: -0.7,61 86.3,61 86.3,-0.4 -0.7,-0.4
  pour Bottom: 86.3,61 -0.7,61 -0.7,-0.2 86.3,-0.2
MISO  (via drill 0.3, 0.3 pad 0.4)
  Top 0.2: IC5.26 80.47,21.5 v80.49,21.51 | v45.6,40.3 SD1.7 45.61,37.73 R2.2
  Bottom 0.2: v80.49,21.51 80.49,23.81 78.6,25.7 77.3,25.7 75.5,27.5 75.5,33.7 70.8,38.4 61.45,38.4 61.1,38.05 59.75,38.05 58.6,39.2 46.7,39.2 v45.6,40.3
MOSI  (via drill 0.3, 0.3 pad 0.4)
  Top 0.2: IC5.25 79.67,21.39 v79.73,21.45 | J1.33 13.75,31.75 14.5,32.5 v14.55,32.45 | v40.79,44.06 41.21,43.64 SD1.3 | v56.24,41.4 58.51,39.13 58.51,38.44 v59.13,37.82
  Top 0.254: IC5.25
  Bottom 0.2: v79.73,21.45 79.73,23.87 78.3,25.3 77,25.3 75.1,27.2 75.1,33.4 70.6,37.9 61.6,37.9 61.3,37.6 59.35,37.6 v59.13,37.82 | v14.55,32.45 14.6,32.4 22.49,32.4 24.46,34.37 24.46,39.83 28.68,44.05 v40.78,44.05 v40.79,44.06 40.85,44.12 53.51,44.12 v56.23,41.4 v56.24,41.4
N$1
  Top 0.2: R3.1 78.18,23.72 79.07,22.82 IC5.17
N$2
  Top 0.2: R1.2 TR1.1
N$3
  Top 0.2: U1.26 69.82,51.52 70.06,51.76 LED1.K
N$13
  Top 0.508: BUZZ1.N 19.83,52.37 20.6,51.6 D6.A 22.46,50.44 23.15,49.75 TR1.3
N$25
  Top 0.254: C1.1 14.15,15.6 13.5,16.25 J1.2
N$26
  Top 0.254: J1.3 13.77,16.75 14.4,16.12 15.35,16.12 16.13,16.9 C5.1
N$28
  Top 0.305: R18.2 61.55,20 C51.1 62.15,19.95 62.3,19.8 IC6.1
N$29  (via drill 0.3)
  Top 0.2: U1.23 71.6,45.4 73.37,47.17 76.14,47.17 v76.26,47.29 | v79.4,51.4 79.4,50.25 CON4.CC1
  Bottom 0.2: v76.26,47.29 79.4,50.43 v79.4,51.4
N$30  (via drill 0.35)
  Top 0.406: D4.A 23.2,34.3 22.77,33.87 v22.77,29.5 | v27.4,29.1 27.4,28.8 27.1,28.5 C29.2
  Top 0.508: FET1.3 26.48,28.48 C29.2 26.5,29.9 L1.2
  Bottom 0.406: v27.4,29.1 27,29.5 v22.77,29.5
N$31
  Top 0.254: J1.15 14.05,22.75 16,20.8 C3.1
N$32
  Top 0.254: J1.16 14.65,23.25 15.9,22 C6.1
N$34
  Top 0.254: J1.17 15.25,23.75 15.8,23.2 C11.1
N$35
  Top 0.254: J1.18 16.45,24.25 C14.1
N$36
  Top 0.254: J1.19 14.55,24.75 15.5,25.7 16.5,25.7 C15.1
N$37
  Top 0.254: J1.20 14.25,25.25 15.8,26.8 C16.1
N$38
  Top 0.254: J1.22 14.25,26.25 16,28 C17.1
N$40
  Top 0.254: J1.23 13.85,26.75 16.3,29.2 C18.1
N$41
  Top 0.254: J1.41 13.55,35.75 14.2,35.1 C21.1
N$42
  Top 0.254: J1.42 13.65,36.25 14.2,35.7 15.3,35.7 C23.1
N$43
  Top 0.254: J1.43 13.95,36.75 14.2,36.5 C23.2
N$44
  Top 0.254: J1.50 13.45,40.25 14.3,41.1 C27.1
N$45
  Top 0.254: C24.1 15.9,37.7 15.55,37.35 13.68,37.35 13.58,37.25 J1.44
N$46
  Top 0.254: J1.45 13.48,37.75 13.58,37.85 15.15,37.85 C25.1
N$47
  Top 0.254: J1.46 13.25,38.25 13.8,38.8 C25.2
N$48
  Top 0.254: J1.37 14.45,33.75 C20.1
N$49
  Top 0.406: D2.A D3.C 24.13,28.77 24.4,28.5 C29.1
N$50
  Top 0.2: FET1.1 24.25,26.9 R4.2 R15.1
N$51
  Top 0.2: IC5.21 L4.2
N$52
  Top 0.2: FET2.1 20.8,15.95 | 20.8,15.95 R7.2 | R8.2 20.7,15.85 20.8,15.95
N$53
  Top 0.2: IC7.2 59.2,32.27 60.15,33.22 64.03,33.22 64.3,32.95 IC12.8
N$54
  Top 0.508: FET2.3 25.3,15 26.3,16 26.3,18.1 L2.1 23.83,18.2 D5.C
N$55
  Top 0.2: IC12.2 62.6,31 62.19,31.41 62.19,31.86 61.76,32.29 60.2,32.29 60,32.09 IC7.1
N$56
  Top 0.2: U1.22 71.65,44.9 72.75,46 C45.1
N$57
  Top 0.305: U1.3 65.35,44.9 65.1,45.15
  Top 0.406: 65.1,45.15 L3.2
N$58
  Top 0.2: U1.16 70.32,39.58 R19.1
N$59  (via drill 0.45)
  Top 0.305: U1.5 65.41,43.9
  Top 0.406: 65.41,43.9 65,43.49 v65,43.3 | v64.9,47.8 64.54,48.16 L5.2
  Bottom 0.406: v65,43.3 65,47.7 v64.9,47.8
N$60  (via drill 0.3)
  Top 0.2: U1.24 71.55,45.9 73.25,47.6 75.61,47.6 v76.16,48.15 | CON4.CC2 78.42,51.38 v78.4,51.4
  Bottom 0.2: v78.4,51.4 78.4,50.39 v76.16,48.15
N$61
  Top 0.2: IC5.2 79.07,19.38 78.7,19 76.4,19 L4.1
N$62
  Top 0.2: R20.2 80.18,3.1 FET3.1 80.2,3.2 R21.2
N$63
  Top 0.2: IC5.12 IC5.11
NRST  (via drill 0.3)
  Top 0.2: IC5.6 81.47,19.02 v81.5,19 | v60.8,43.2 60.9,43.1 60.9,35.09 v60.94,35.05 | v60.92,50.73 60.94,50.75 C12.1 61.63,51.53 62.33,52.23 CON3.1 63.92,53.45 64.23,53.14 R14.2
  Bottom 0.2: v81.5,19 81.1,19.4 76.8,19.4 75.5,20.7 75.5,23.2 72.6,26.1 72.6,32.1 69.1,35.6 62.85,35.6 62.35,35.1 60.99,35.1 v60.94,35.05 | v60.92,50.73 60.6,50.41 60.6,43.3 60.7,43.2 v60.8,43.2
RESEC
  Top 0.2: J1.10 15.75,20.25 16,20 21.1,20 21.46,20.36 R5.1
  Top 0.508: R5.1 26.04,20.36 L2.2
RESEH  (via drill 0.3)
  Top 0.2: v14.3,18.7 14.25,18.75 13.98,18.75 13.48,18.25 J1.6 | v21.2,23.6 21.2,24.1 21.3,24.2 21.6,24.2 21.7,24.1 22.04,24.44 R16.1
  Top 0.508: FET1.2 23.29,24.95 22.94,24.6 R16.1
  Bottom 0.2: v14.3,18.7 14.4,18.6 16.5,18.6 21.2,23.3 v21.2,23.6
RST_N  (via drill 0.3, 0.3 pad 0.4)
  Top 0.2: IC5.22 79.64,20.79 | J1.28 13.35,29.25 13.7,28.9 v14.3,28.9 | v59.31,35.3 59.13,35.48 58.4,35.48 54.52,39.36 53.98,39.36 52.75,40.59 v52.7,40.59
  Top 0.254: 79.64,20.79 v79.75,20.68
  Bottom 0.2: v79.75,20.68 76.72,20.68 76.1,21.3 76.1,23.2 73.1,26.2 73.1,32.4 69.4,36.1 62.6,36.1 62.15,35.65 59.59,35.65 59.31,35.37 v59.31,35.3 | v14.3,28.9 15.3,28.9 16.5,30.1 24.31,30.1 27.01,32.8 27.01,38.33 30.25,41.57 51.75,41.57 52.7,40.62 v52.7,40.59
SCL  (via drill 0.3)
  Top 0.2: IC5.8 82.67,17.43 82.85,17.25 R12.2 82.85,15.75 82.6,15.5 v82.6,15.3 | U1.14 69.32,31.43 v68.55,30.65 | v77.06,4.97 73.97,4.97 72.2,3.2 66.9,3.2 v66.6,2.9 65.95,2.25 IC2.5 64.48,2.25 v64.37,2.36 | IC11.4 68.45,23.8 v68.55,23.7 | IC6.6 66.2,19.8 66.73,20.33 v68.57,20.33 | v59.3,2.2 57.59,3.91 IC1.P3 | v64.2,28.2 v68.55,28.2 | IC12.1 63.22,32.1 62.68,32.1 62.45,32.33 v62.45,32.63
  Bottom 0.2: v82.6,15.3 81.49,14.19 81.49,9.4 v77.06,4.97 | v66.6,2.9 66.6,2.95 68.55,4.9 68.55,20.31 v68.57,20.33 68.55,20.35 v68.55,23.7 v68.55,28.2 v68.55,30.65 | v64.37,2.36 59.46,2.36 v59.3,2.2 | v62.45,32.63 62.45,29.95 v64.2,28.2
SDA  (via drill 0.3)
  Top 0.2: IC5.7 82.07,18.38 80.8,17.1 80,17.1 79.75,16.85 R13.2 79.75,15.25 v79.6,15.1 | U1.13 68.82,32.23 v67.95,31.35 | IC6.3 63,17.4 v63.2,17.2 | IC11.3 v67.95,24.6 | IC12.5 65.32,29.02 65.5,28.85 67.8,28.85 v67.95,29 | IC1.P4 75.92,8.56 75.49,8.13 75.49,7.33 71.91,3.75 66.3,3.75 v66.2,3.75 IC2.8
  Bottom 0.2: v67.95,31.35 v67.95,29 v67.95,24.6 67.95,17.2 | v79.6,15.1 79.6,10.28 77.88,8.56 IC1.P4 | v66.2,3.75 67.95,5.5 67.95,17.2 | v63.2,17.2 67.95,17.2
SW1  (via drill 0.3, 0.3 pad 0.4)
  Top 0.2: IC5.10 83.1,21.47 v83.13,21.5 | v80,35.6 79.35,36.25 S1.1
  Bottom 0.2: v83.13,21.5 83.26,21.63 83.26,32.44 80.1,35.6 v80,35.6
SW2  (via drill 0.3, 0.3 pad 0.4)
  Top 0.2: IC5.23 81.25,20.72 v81.25,20.69 | v81.5,30.1 80.1,30.1 78.95,31.25 S1.2
  Bottom 0.2: v81.25,20.69 81.45,20.69 81.9,21.14 81.9,21.8 81.7,22 81.7,23.9 81.3,24.3 81.3,29.9 v81.5,30.1
SWCLK  (via drill 0.3)
  Top 0.2: IC5.15 80.28,23.73 79.2,24.8 79.2,25.5 78.8,25.9 v78.8,26.3 | v59.51,39.09 59.43,39.17 v59.43,43.56
  Bottom 0.2: v78.8,26.3 77.5,26.3 76,27.8 76,33.9 71.1,38.8 61.05,38.8 60.75,38.5 60.1,38.5 v59.51,39.09 | CON3.5 59.3,51.4 59.3,43.69 v59.43,43.56
SWDIO  (via drill 0.3)
  Top 0.2: IC5.14 80.88,23.73 79.7,24.9 79.7,26 v79.6,26.1 | v60.06,42.71 60.06,39.34 v60.3,39.1
  Bottom 0.2: v79.6,26.1 79.6,26.4 79.1,26.9 77.6,26.9 76.4,28.1 76.4,34.2 71.4,39.2 60.4,39.2 v60.3,39.1 | CON3.3 59.99,53.25 59.99,42.78 v60.06,42.71
SWT  (via drill 0.3, 0.3 pad 0.4)
  Top 0.2: IC5.24 81.69,21.48 v81.26,21.48 | v79.4,33.2 78.4,33.2 S1.T
  Bottom 0.2: v81.26,21.48 81.26,23.68 80.86,24.08 80.86,30.24 79.4,31.7 v79.4,33.2
V_B  (via drill 0.45, 0.5)
  Top 0.2: R8.1 21.9,13.85 FET2.2
  Top 0.508: L1.1 C30.1 | v22.98,40.59 22.98,41.55 C35.1 R17.2 | v23,12.4 22.9,12.3 C33.1 22.1,12.4 FET2.2 | C30.1 26.09,33.9 25.83,34.16 25.83,35.48 23.82,37.49 v23.03,37.49 | v28,33.82 26.88,33.82 C30.1
  Bottom 0.508: v23,12.4 23.1,12.4 28.16,17.46 28.16,33.66 v28,33.82 | v22.98,40.59 23.03,40.54 v23.03,37.49
VBAT  (via drill 0.45, 0.5)
  Top 0.305: U1.19 71.8,43.4 71.9,43.3
  Top 0.406: 71.9,43.3 72.1,43.1 C22.1 73.8,43.1 74.2,42.7 v74.2,41.7
  Top 0.508: CN1.P$1 54.53,47.38 52.25,49.66 v52.25,52.31 | v26.39,53.33 25.53,53.33 23.72,55.14 9.77,55.14 8.75,54.12 8.75,48.63 v7.63,47.51
  Bottom 0.508: CN1.P$1 54.53,45.46 58.93,41.06 61.06,41.06 61.33,41.33 62.5,41.33 62.77,41.06 73.56,41.06 v74.2,41.7 | v52.25,52.31 51.23,53.33 v26.39,53.33 | v7.63,47.51 7.63,38.54 PT1.P$1
VBUS
  Top 0.305: U1.21 71.9,44.4 72,44.5
  Top 0.406: CON4.VB2 80.44,48.89 79.57,48.02 79.27,48.02 78.65,48.02 77.41,49.27 CON4.VB1
  Top 0.508: 72,44.5 72.3,44.8 C50.1 78.96,45.84 79.26,46.14 D1.1 79.26,48.01 79.27,48.02
VCC
  Top 0.2: R21.1 81.49,5
  Top 0.508: SW1.1 81.49,5 80.18,5 FET3.2
VGH  (via drill 0.35)
  Top 0.254: J1.49 14.05,39.75 14.2,39.9 v15.7,39.9 | v11.6,22.5 11.85,22.25 J1.14
  Top 0.305: v20.59,35.98 20.86,35.7
  Top 0.406: C31.1 v15.7,39.9 | 20.86,35.7 D4.C | v11.4,27.8 10.8,27.2 v10.8,25.3
  Bottom 0.406: v20.59,35.98 16.67,39.9 v15.7,39.9 15.05,39.9 10.53,35.38 10.53,28.67 v11.4,27.8 | v10.8,25.3 11.6,24.5 v11.6,22.5
VGL  (via drill 0.35)
  Top 0.305: v13.79,22.06 13.48,21.75 J1.13
  Top 0.406: v19.72,28.86 19.5,29.08 C32.1 19.7,30.2 D3.A
  Bottom 0.406: v19.72,28.86 19.5,29.08 17.12,29.08 13.79,25.75 v13.79,22.06
VOUT1  (via drill 0.45)
  Top 0.305: U1.1 65.55,45.9 65.5,45.95
  Top 0.406: 65.5,45.95 64.59,46.86 L3.1
  Top 0.508: v56.73,49.48 58.56,49.48 61,47.04 C42.1 61.8,46.5 62.16,46.86 L3.1 | R11.1 R17.1 | R17.1 | v23.34,46.19 23.01,45.86 R17.1
  Bottom 0.508: v56.73,49.48 56.41,49.48 51.71,54.18 25.98,54.18 23.34,51.54 v23.34,46.19
VOUT2  (via drill 0.3, 0.35)
  Top 0.2: C43.1 66.2,52.26 66.06,52.4 R14.1 66.06,54.61 65.99,54.68 v65.97,54.68 | v61.85,54.78 61.06,53.99 CON3.2
  Top 0.305: IC5.19 77.81,21.69 77.4,22.1 C52.1 | U1.12 68.32,40.42 68,40.1 67.9,40.1 | U1.32 66.82,47.17 66.7,47.3
  Top 0.406: L5.1 66.26,47.74 66.7,47.3
  Top 0.508: v77.7,15.55 77.7,11.9 82.2,7.4 82.24,7.39 82.63,7 SW1.2 | v73.95,22.15 74,22.1 C52.1 | v67.1,51.3 C43.1 66.2,49.26 | v64.9,42.3 66.6,40.6 C49.1 67.9,40.1 68.2,39.8 v68.2,34.05
  Bottom 0.2: v65.97,54.68 65.76,54.89 61.96,54.89 v61.85,54.78
  Bottom 0.508: v77.7,15.55 77.6,15.55 73.95,19.2 v73.95,22.15 73.95,22.4 70.9,25.45 70.9,31.4 68.25,34.05 v68.2,34.05 | v67.1,51.3 66.8,51.3 66,50.5 66,42.7 65.6,42.3 v64.9,42.3
VPC  (via drill 0.35)
  Top 0.305: v15.5,19.6 15.6,19.5 18.9,19.5 19.1,19.3 C34.1 20.06,18.5 D5.A | v14.95,20.87 14.83,20.75 J1.11
  Bottom 0.305: v15.5,19.6 15.5,20 14.95,20.55 v14.95,20.87
VSYS  (via drill 0.3, 0.45)
  Top 0.2: 61.7,43.4 61.7,43.65 v61.45,43.9 | v61.73,50.73 62.92,51.92 62.92,52.53 63.16,52.77 v63.37,52.77 | v67.59,53.37 68.53,53.37 LED1.A
  Top 0.305: 65.1,44.4 U1.4 | U1.20 72.2,43.9
  Top 0.406: C48.1 C47.1 64.3,43.7 65,44.4 65.1,44.4 | 72.2,43.9 75.07,43.9 C46.1
  Top 0.508: C48.1 62,43.7 61.7,43.4 61.7,40.7 v62,40.4 | v76.1,43.9 76.03,43.97 C46.1
  Bottom 0.2: v61.45,43.9 61.05,44.3 61.05,49.86 61.73,50.54 v61.73,50.73 | v63.37,52.77 63.97,53.37 v67.59,53.37
  Bottom 0.508: v62,40.4 62.02,40.38 74.28,40.38 76.2,42.3 76.2,43.8 v76.1,43.9

### Text on the board
tPlace: 502535 400mAh | Env Sensor V1.0 | https://dddev.group/
bPlace: +V